# Altium schematic sheet Power.SchDoc
size A4
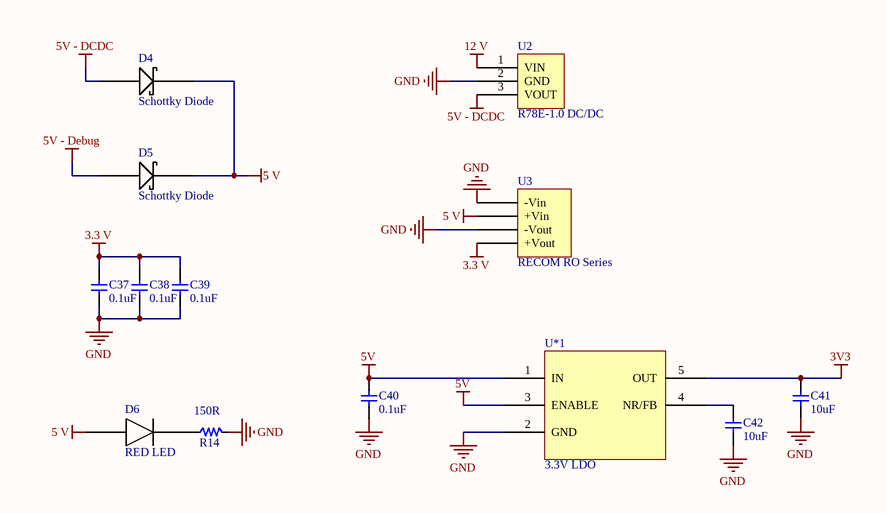
[diagram p0: Power.SchDoc]

## Parts
C37  value 0.1uF  [PCB_GENERIC_SMD_0603]  (hidden comment: C060-000U1-00)
C38  value 0.1uF  [PCB_GENERIC_SMD_0603]  (hidden comment: C060-000U1-00)
C39  value 0.1uF  [PCB_GENERIC_SMD_0603]  (hidden comment: C060-000U1-00)
C40  value 0.1uF  [PCB_GENERIC_SMD_0603]  (hidden comment: C060-000U1-00)
C41  value 10uF  [PCB_GENERIC_SMD_0603]  (hidden comment: C060-0010U-00)
C42  value 10uF  [PCB_GENERIC_SMD_0603]  (hidden comment: C060-0010U-00)
D4  Schottky Diode  [ON Semi Schottky Diode - MBRM110LT1G]
D5  Schottky Diode  [ON Semi Schottky Diode - MBRM110LT1G]
D6  RED LED  [SMD_0603_LED]
R14  SCH_GENERIC_RESISTOR_0603  [PCB_GENERIC_SMD_0603]  (value not drawn)
U2  R78E-1.0 DC/DC  [R78-1.0]
U3  RECOM RO Series  [RECOM RO Series 1W DCDC]
U*1  3.3V LDO  [SOT95P280X145-5N]

## Nets
3.3 V: C37.2 C38.2 C39.2 U3.4(+Vout)
3V3: C41.2 U*1.5(OUT)
5 V: D4.1 D5.1 D6.1 U3.2(+Vin)
5V: C40.2 U*1.1(IN) U*1.3(ENABLE)
5V - DCDC: D4.2 U2.3(VOUT)
5V - Debug: D5.2
12 V: U2.1(VIN)
GND: C37.1 C38.1 C39.1 C40.1 C41.1 C42.1 R14.2 U2.2(GND) U3.1(-Vin) U3.3(-Vout) U*1.2(GND)
NetC42_2: C42.2 U*1.4(NR/FB)
NetD6_2: D6.2 R14.1

## Notes on the sheet
- (near R14) 150R

## Library data of the parts
C37-C40 = C060-000U1-00: CAP CER 0603 0.1uF 16V X5R 20%; Tolerance: 20%; Voltage: 16V; Package: 0603
C41 C42 = C060-0010U-00: CAP CER 0603 10uF 6.3V X5R 20%; Tolerance: 20%; Voltage: 6.3V; Package: 0603
D4 D5 = ON Semi Schottky Diode - MBRM110LT1G
D6 = SMD_0603_LED
R14 = SCH_GENERIC_RESISTOR_0603: Generic SMD resistor 0603; Resistance: *
U2 = R78E-1.0
U3 = RECOM RO Series DCDC Converter
U*1 = 3V3LDO_TPS73633DBVR_SOT23-5: Linear Voltage Regulator IC Positive Fixed 1 Output 3.3V 400mA SOT-23-5